# Altium schematic sheet Power_Supplies.SchDoc
size 594 x 420 mm; SheetNumber: 1; SheetTotal: 2
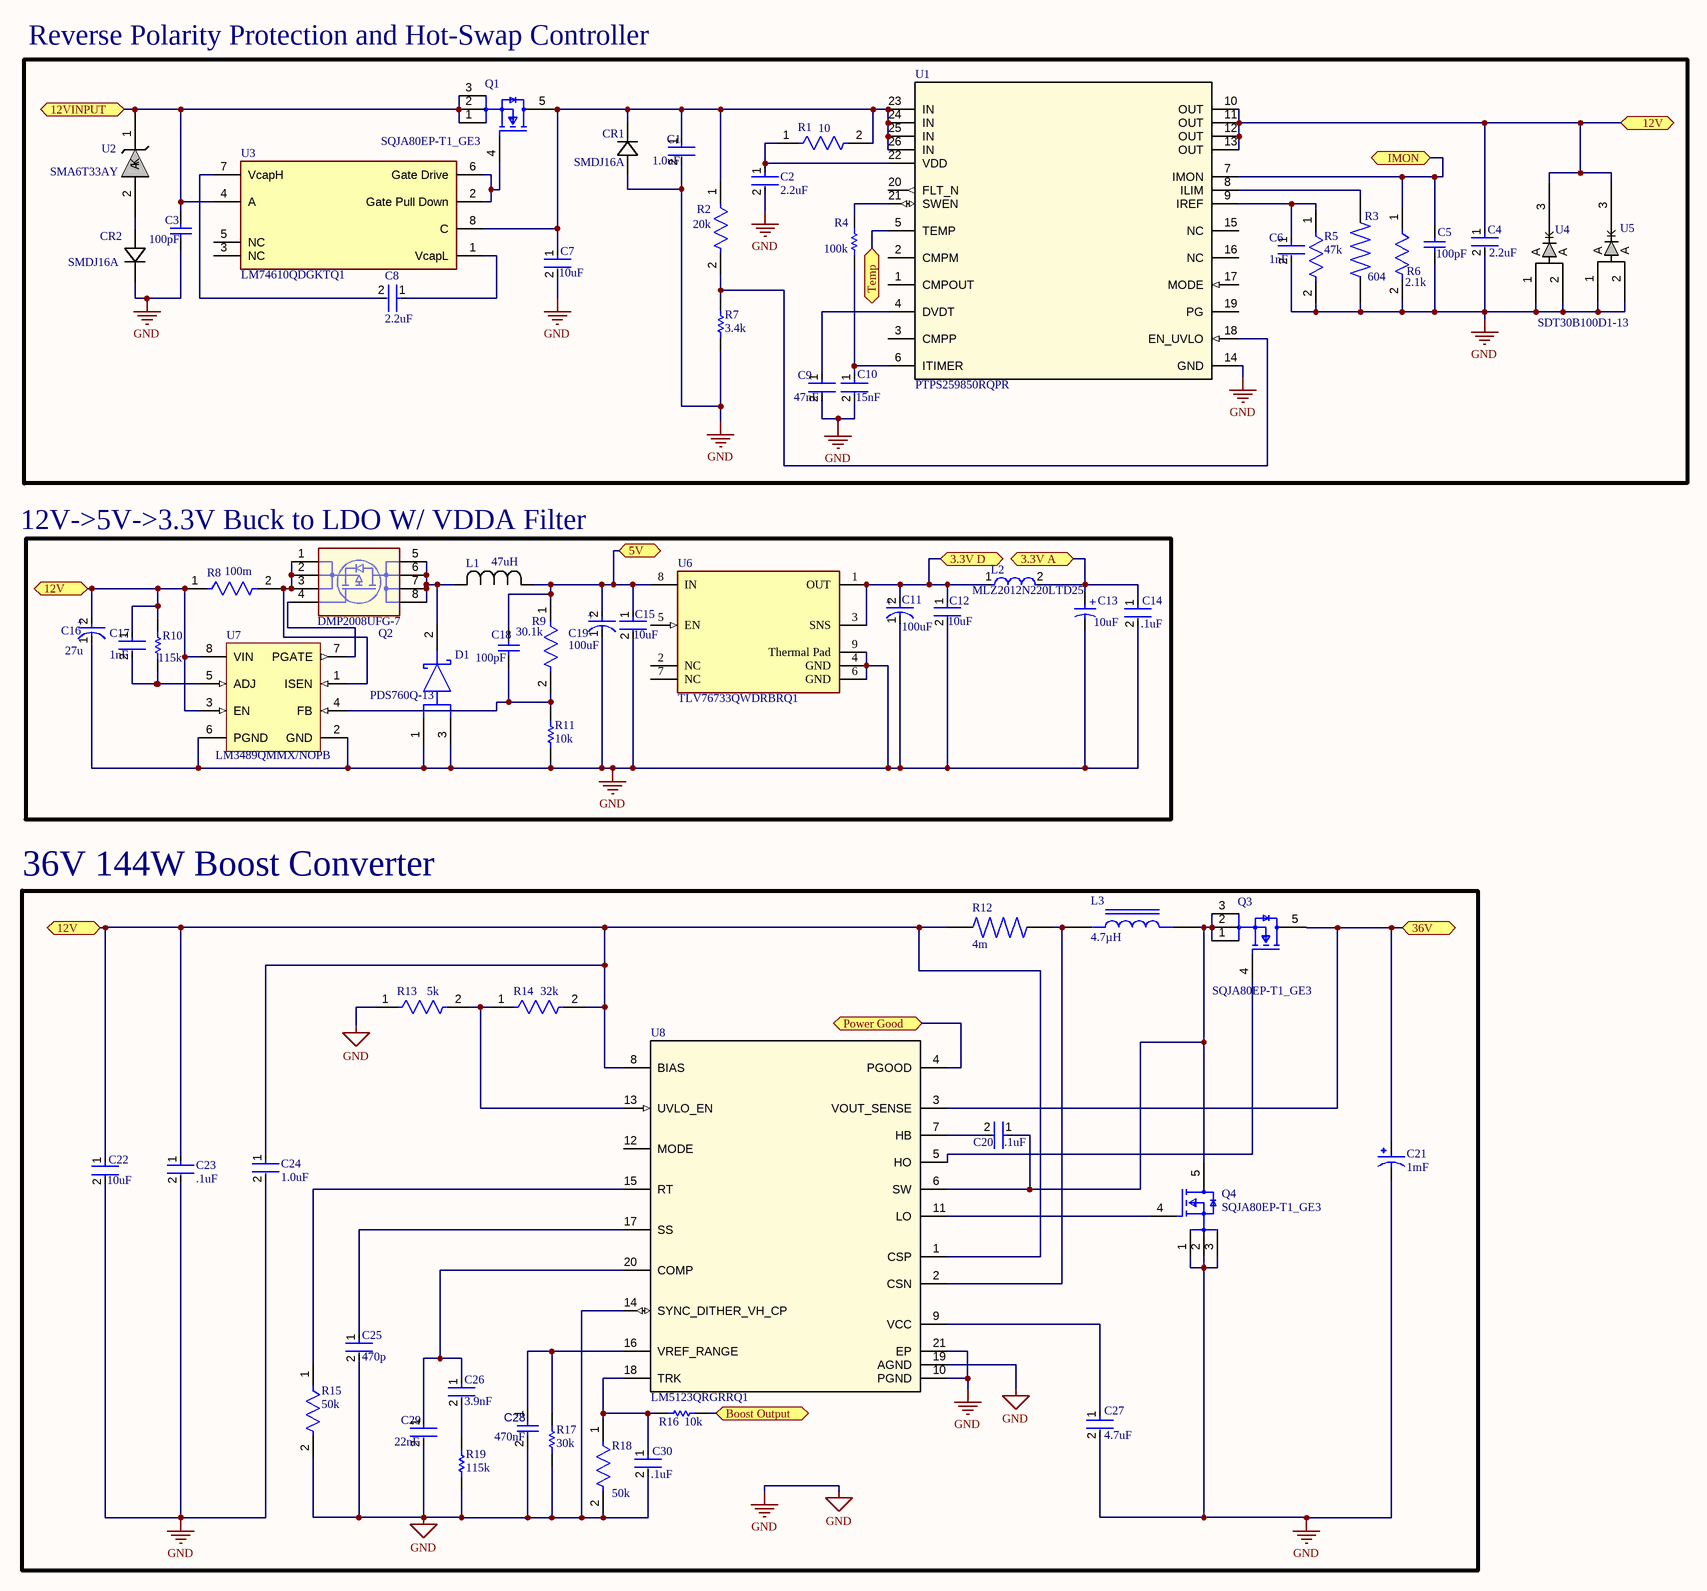
[diagram p0: Power_Supplies.SchDoc]

## Parts
C1  1.0uF  [FP-GRM155-0_1-MFG]
C2  2.2uF  [FP-GRM155-0_2-IPC_B]
C3  100pF  [CAPC1005X55X25ML05T05]
C4  2.2uF  [FP-GRM155-0_2-IPC_B]
C5  100pF  [CAPC1005X55X25ML05T05]
C6  1nF  [FP-C1005-050-0_05-IPC_B]
C7  10uF  [FP-CL21-IPC_A]
C8  2.2uF  [FP-GRM155-0_2-IPC_B]
C9  47nF  [FP-C1005-050-0_05-IPC_B]
C10  15nF  [FP-GRT155-0_05-IPC_A]
C11  100uF  [FP-FKF-MFG]
C12  10uF  [FP-CL21-IPC_A]
C13  10uF  [WCAP-ASLI_D4H5.5]
C14  .1uF  [FP-GRM155-0_05-MFG]
C15  10uF  [FP-CL21-IPC_A]
C16  27u  [FP-OS-CON-SMT-C6-MFG]
C17  1nF  [FP-C1005-050-0_05-IPC_B]
C18  100pF  [CAPC1005X55X25ML05T05]
C19  100uF  [FP-FKF-MFG]
C20  .1uF  [FP-GRM155-0_05-MFG]
C21  value 1mF  [CAP_EEEFK1H102AV]  (hidden comment: EEEFK1H102AV)
C22  10uF  [FP-CL21-IPC_A]
C23  .1uF  [FP-GRM155-0_05-MFG]
C24  1.0uF  [FP-GRM155-0_1-MFG]
C25  470p  [FP-GCM155-0_1-IPC_A]
C26  3.9nF  [FP-CC0402-MFG]
C27  4.7uF  [FP-CL829-IPC_C]
C28  value 470nF  [CAPC0402(1005)60_L]  (hidden comment: Capacitor 470nF +/-40% 10V 0402)
C29  22nF  [FP-0402-L_1_0_0_05-W_0_5-IPC_B]
C30  .1uF  [FP-GRM155-0_05-MFG]
CR1  SMDJ16A  [SMDJSeries_LTF]
CR2  SMDJ16A  [SMDJSeries_LTF]
D1  PDS760Q-13  [FP-PowerDI5-MFG]
L1  47uH  [IND_PA4343PM4343_FP2_PUL]
L2  MLZ2012N220LTD25  [FP-MLZ2012-1_25-IPC_A]
L3  value 4.7µH  [IND_PQ2614BLA-4R7K]  (hidden comment: PQ2614BLA-4R7K)
Q1  SQJA80EP-T1_GE3  [FP-S19-0643-SINGLE-MFG]
Q2  DMP2008UFG-7  [DMP2008UFG-7_DIO]
Q3  SQJA80EP-T1_GE3  [FP-S19-0643-SINGLE-MFG]
Q4  SQJA80EP-T1_GE3  [FP-S19-0643-SINGLE-MFG]
R1  10  [FP-RP73P-1E-MFG]
R2  20k  [FP-AC0402-IPC_A]
R3  value 604  [RES_ERA3AEB6040V]  (hidden comment: ERA3AEB6040V)
R4  100k  [RESC1005X40X25ML05T10]
R5  47k  [FP-RT0603-MFG]
R6  2.1k  [FP-RG1608-IPC_C]
R7  3.4k  [RESC2013X60X30ML20T20]
R8  100m  [FP-CSRN2512-IPC_B]
R9  30.1k  [FP-RK73H1E-MFG]
R10  115k  [RESC1005X40X25ML05T10]
R11  10k  [RESC1005X40X25ML05T10]
R12  value 4m  [RESC6331X87N]  (hidden comment: TLR3APDTE4L00F75)
R13  5k  [FP-RC0402-MFG]
R14  32k  [FP-RN73R1E-IPC_C]
R15  50k  [FP-CRCW0402-e3-IPC_A]
R16  10k  [RESC1005X40X25ML05T10]
R17  30k  [RESC2013X60X35LL10T20]
R18  50k  [FP-CRCW0402-e3-IPC_A]
R19  115k  [RESC1005X40X25ML05T10]
U1  PTPS259850RQPR  [RQP0026A-MFG]
U2  SMA6T33AY  [SMA_UNI_STM]
U3  LM74610QDGKTQ1  [FP-DGK0008A-MFG]
U4  SDT30B100D1-13  [TO252_DIO]  (value not drawn)
U5  SDT30B100D1-13  [TO252_DIO]
U6  TLV76733QWDRBRQ1  [FP-DRB0008J-IPC_C]
U7  LM3489QMMX/NOPB  [DGK0008A_M]
U8  LM5123QRGRRQ1  [RGR0020C-IPC_A]

## Blocks framed on the sheet
Reverse Polarity Protection and Hot-Swap Controller: C1-C10 CR1 CR2 Q1 R1-R7 U1-U5
36V 144W Boost Converter: C20-C30 L3 Q3 Q4 R12-R19 U8

## Ports
3.3V A (bidir, see MCU[6C]), 3.3V D (bidir, see MCU[3D], MCU[3G], MCU[4D], MCU[6D], MCU[6F], MCU[7D], MCU[7F], MCU[7G], MCU[8F], MCU[9F], MCU[10C], MCU[10F]), 5V (bidir, see MCU[5F]), 12V (bidir, see Power_Supplies[2C], Power_Supplies[2D]), 12V (bidir, see Power_Supplies[2C], Power_Supplies[6B]), 12V (bidir, see Power_Supplies[2D], Power_Supplies[6B]), 12VINPUT (bidir, see MCU[8F]), 36V (bidir, see MCU[4F], MCU[4G]), Boost Output (bidir, see MCU[9D]), IMON (bidir, see MCU[7D]), Power Good (bidir, see MCU[7D]), Temp (bidir, see MCU[9C])

## Nets
GND: C1.2 C2.2 C3.2 C4.2 C5.2 C6.2 C7.2 C9.2 C10.2 C11.1(C) C12.2 C13.2(N) C14.2 C15.2 C16.1(C) C19.1(C) C21.2 C22.2 C23.2 C24.2 C25.2 C27.2 C28.2 C29.2 C30.2 CR1.2 CR2.1 D1.1(A) D1.3(A) Q4.1(S) Q4.2(S) Q4.3(S) R3.2 R5.2 R6.2 R7.2 R11.2 R13.1 R15.2 R17.2 R18.2 R19.2 U1.14(GND) U4.1(A) U4.2(A) U5.1(A) U5.2(A) U6.4(GND) U6.6(GND) U6.9(Thermal_Pad) U7.2(GND) U7.6(PGND) U8.10(PGND) U8.14(SYNC_DITHER_VH_CP) U8.19(AGND) U8.21(EP)
3.3V A: C13.1(P) C14.1 L2.2 ; port 3.3V A
3.3V D: C11.2(A) C12.1 L2.1 U6.1(OUT) U6.3(SNS) ; port 3.3V D
5V: C15.1 C18.1 C19.2(A) L1.1 R9.1 U6.8(IN) ; port 5V
12V: C4.1 C16.2(A) C17.1 C22.1 C23.1 C24.1 R8.1 R10.1 R12.1 R14.2 U1.10(OUT) U1.11(OUT) U1.12(OUT) U1.13(OUT) U4.3(K) U5.3(K) U7.3(EN) U7.8(VIN) U8.1(CSP) U8.8(BIAS) ; port 12V
12VINPUT: C3.1 Q1.1(S) Q1.2(S) Q1.3(S) U2.1(K) U3.4(A) ; port 12VINPUT
36V: C21.1 Q3.5(D) U8.3(VOUT_SENSE) ; port 36V
Boost Output: R16.1 ; port Boost Output
IMON: C5.1 R6.1 U1.7(IMON) ; port IMON
Power Good: U8.4(PGOOD) ; port Power Good
Temp: U1.5(TEMP) ; port Temp
NetC1_1: C1.1 C7.1 CR1.1 Q1.5(D) R1.2 R2.1 U1.23(IN) U1.24(IN) U1.25(IN) U1.26(IN) U3.8(C)
NetC2_1: C2.1 R1.1 U1.22(VDD)
NetC6_1: C6.1 R5.1 U1.9(IREF)
NetC8_1: C8.1 U3.1(VcapL)
NetC8_2: C8.2 U3.7(VcapH)
NetC9_1: C9.1 U1.4(DVDT)
NetC10_1: C10.1 R4.2 U1.6(ITIMER)
NetC17_2: C17.2 R10.2 U7.5(ADJ)
NetC18_2: C18.2 R9.2 R11.1 U7.4(FB)
NetC20_1: C20.1 L3.2 Q3.1(S) Q3.2(S) Q3.3(S) Q4.5(D) U8.6(SW)
NetC20_2: C20.2 U8.7(HB)
NetC25_1: C25.1 U8.17(SS)
NetC26_1: C26.1 C29.1 U8.20(COMP)
NetC26_2: C26.2 R19.1
NetC27_1: C27.1 U8.9(VCC)
NetC28_1: C28.1 R17.1 U8.16(VREF_RANGE)
NetC30_1: C30.1 R16.2 R18.1 U8.18(TRK)
NetCR2_2: CR2.2 U2.2(A)
NetD1_2: D1.2(C) L1.2 Q2.5(D) Q2.6(D) Q2.7(D) Q2.8(D)
NetL3_1: L3.1 R12.2 U8.2(CSN)
NetQ1_4: Q1.4(G) U3.2(Gate_Pull_Down) U3.6(Gate_Drive)
NetQ2_1: Q2.1(S) Q2.2(S) Q2.3(S) R8.2 U7.1(ISEN)
NetQ2_4: Q2.4(G) U7.7(PGATE)
NetQ3_4: Q3.4(G) U8.5(HO)
NetQ4_4: Q4.4(G) U8.11(LO)
NetR2_2: R2.2 R7.1 U1.18(EN_UVLO)
NetR3_1: R3.1 U1.8(ILIM)
NetR4_1: R4.1 U1.21(SWEN)
NetR13_2: R13.2 R14.1 U8.13(UVLO_EN)
NetR15_1: R15.1 U8.15(RT)

Not connected (* = marked no-connect by the designer): U1 1(CMPOUT) 2(CMPM) 3(CMPP) 15(NC) 16(NC) 17(MODE) 19(PG) 20(FLT_N); U3 3(NC) 5(NC); U6 2(NC) 5(EN) 7(NC); U8 12(MODE)

## Notes on the sheet
- (near Q2) 12V->5V->3.3V Buck to LDO W/ VDDA Filter
- DWG NO:
- REV:
- THIS DOCUMENT AND THE DATA DISCLOSED HEREIN OR
- HEREWITH IS THE PROPERTY OF ALTIUM LIMITED AND MAY
- BE FREELY DISTRIBUTED IN WHOLE. NO RIGHTS ARE
- RESERVED OR EXPRESS OR IMPLIED WARANTEE GIVEN.
- REVISION
- DESCRIPTION
- DATE
- APPROVED
- ENG:
- APPROVALS
- PROJECT
- DSN:
- CHK:
- REFERENCE DOCUMENTS
- PROJECT REVISION:
- TITLE
- DOCUMENT REVISION:
- DESIGN ITEM:
- BOM:
- FAB DWG:
- PCB DWG:
- ASSY DWG:
- SCALE:
- A2
- SIZE
- CAGE CODE
- FILE NAME
- DWG NO.
- SHEET
- OF
- REV
- (in symbol CMP-2000-06208-3) +
- (in symbol CMP-03913-53914566-1) +
- (in symbol CMP-05428-000702-1) +

## Library data of the parts
C1 C24 = CMP-06035-041084-1: Chip Multilayer Ceramic Capacitors for General Purpose, 0402, 1.0uF, X5R, 15%, 10%, 50V
C2 C4 C8 = CMP-06035-001793-1: Chip Multilayer Ceramic Capacitors for General Purpose, 0402, 2.2uF, X5R, 15%, 10%, 16V; Tolerance: 10%; Capacitance: 2.2uF; Packaging: Tape and Reel; Lead Free: Lead Free; Mount: Surface Mount; Width: 0.02inch; Case/Package: 0402; Case Code (Metric): 1005; Thickness: 0.022inch; Max Operating Temperature: 85°C; Min Operating Temperature: -55°C; Voltage Rating: 16V; Voltage Rating (DC): 16V; Material: Ceramic; Height: 0.3mm; Case Code (Imperial): 0402; Length: 0.039inch; Value: 2.2uF
C3 C5 = CMP-2008-01232-1: Multilayer Ceramic Capacitor, 100 pF, 25 V, ± 10%, X7R, 0402 [1005 Metric]; Part Number: VJ0402Y101KXXPW1BC; Manufacturer: Vitramon
C6 C17 = CMP-08246-005584-1: Multilayer Ceramic Capacitors 1nF ±5% 100V C0G SMD 0402; Voltage Rating: 100V; Termination: SMD/SMT; Width: 0.5mm; Packaging: Tape and Reel; Max Operating Temperature: 125°C; Length: 0.039inch; Capacitance: 1nF; Case Code (Metric): 1005; Dielectric: C0G; Height: 0.5mm; Package Quantity: 10000; Weight: 2.3E-05oz; Thickness: 0.022inch; Case/Package: 0402; RoHS Compliant: Yes; Case Code (Imperial): 0402; Min Operating Temperature: -55°C; Mount: Surface Mount; Voltage Rating (DC): 100V; Tolerance: 5%; Value: 1nF
C7 C12 C15 C22 = CMP-13271-002975-1: CL21 Series 0805 10uF 25V ±10% Tolerance X5R Multilayer Ceramic Chip Capacitor; Case Code (Imperial): 0805; Length: 2mm; Case/Package: 0805; Packaging: Tape and Reel; Width: 0.049inch; Tolerance: 10%; Mount: Surface Mount; Min Operating Temperature: -55°C; Thickness: 0.057inch; Height: 1.25mm; Dielectric: X5R; Package Quantity: 1; Depth: 1.25mm; Capacitance: 10uF; Voltage Rating: 25V; Case Code (Metric): 2012; Max Operating Temperature: 85°C; Radiation Hardening: No; Value: 10uF
C9 = CMP-08246-006396-1: Multilayer Ceramic Capacitors 47nF ±10% 35V X7R SMD 0402; Lead Free: Lead Free; Height: 0.5mm; RoHS Compliant: Yes; Dielectric: X7R; Thickness: 0.022inch; Length: 1mm; Capacitance: 47nF; Min Operating Temperature: -55°C; Width: 0.02inch; Voltage Rating: 35V; Construction: Flat; Package Quantity: 1; Packaging: Tape and Reel; Tolerance: 10%; Voltage Rating (DC): 35V; Case Code (Imperial): 0402; Case Code (Metric): 1005; Dielectric Material: Ceramic; Mount: Surface Mount; Depth: 0.5mm; Weight: 2.3E-05oz; Termination: SMD/SMT; Case/Package: 0402; Series: C; Max Operating Temperature: 125°C; Value: 47nF
C10 = CMP-06035-035184-1: Multi-Layer Ceramic Capacitor 15nF 50V X7R ±10% 0402 Paper T/R
C11 C19 = CMP-2000-06208-3: Radial Can - SMD ALUMINUM ELECTROLYTIC CAPACITOR FK 50V 100muF ±20% 0.315Dia 8.00mm; Leakage Current: 3uA; ESR (Equivalent Series Resistance): 340mR; Material: Aluminium; Ripple Current: 350mA; Life (Hours): 2000Hour; Min Operating Temperature: -55°C; Contact Plating: Tin; REACH SVHC: No SVHC; RoHS Compliant: Yes; Width: 10mm; Radiation Hardening: No; Termination: SMD/SMT; Packaging: Tape and Reel; Max Operating Temperature: 105°C; Case/Package: Radial; Voltage Rating: 50V; Length: 10.2mm; Voltage: 50V; Package Quantity: 1; Voltage Rating (DC): 50V; Height - Seated (Max): 0.402inch; Mount: Surface Mount; Impedance: 340mR; Construction: Cylindrical; Height: 10.2mm; Lead Free: Lead Free; Dielectric Material: Aluminium; Series: FK; Tolerance: 20%; Diameter: 8mm; Ripple Current (AC): 350mA; Capacitance: 100uF; Number of Pins: 2; Value: 100uF
C13 = CMP-03913-53914566-1: 865080340001 WCAP-ASLI Aluminum Electrolytic Capacitors; Impedance: 2.2Ω; ESR (Equivalent Series Resistance): 1.66693Ω; Life (Hours): 2000hours; Ripple Current (AC): 80mA; Capacitance: 10µF; Voltage Rating (DC): 16V; Polarity: Polar; Leakage Current: 3µA; Insulation Resistance: 5.33333MΩ; Tolerance: 20%; Value: 10µF; Case/Package: Radial; Min Operating Temperature: -55°C; Height: 5.5mm; Lead Free: Lead Free; Packaging: Tape & Reel (TR); REACH SVHC: Unknown; Length: 5.5mm; Height - Seated (Max): 5.5118mm; Max Operating Temperature: 105°C; NexarPartId: 53914566; Diameter: 4mm; Ripple Current: 80mA; Mount: Surface Mount; RoHS: Compliant; Voltage Rating: 16V; Width: 4.3mm
C14 C20 C23 C30 = CMP-06035-023139-1: Chip Multilayer Ceramic Capacitors for General Purpose, 0402, 0.10uF, B, 10%, 10%, 50V; Capacitance: 100nF; Value: 100nF; Length: 1mm; Width: 500um; Voltage Rating (DC): 50V; Lead Free: Lead Free; Tolerance: 10%; Thickness: 500um
C16 = CMP-05428-000702-1: Conductive Polymer Aluminum Solid Capacitors (OS-CON) 27uF ±20% 20V; Ripple Current (AC): 1.45A; Polarity: Polar; Leakage Current: 108uA; ESR (Equivalent Series Resistance): 60mR; Life (Hours): 2000Hour; Dissipation Factor: 10%; Capacitance: 27uF; Max Operating Temperature: 105°C; Min Operating Temperature: -55°C; Termination: SMD/SMT; Packaging: Tape and Reel; Voltage Rating: 20V; Mount: Surface Mount; REACH SVHC: No SVHC; Construction: Cylindrical; Height - Seated (Max): 0.236inch; Ripple Current: 1.45A; Series: OS-CON™, SVP; Number of Pins: 6; Voltage: 20V; Package Quantity: 1000; Voltage Rating (DC): 20V; RoHS Compliant: Yes; Length: 5.9mm; Case/Package: Radial; Diameter: 6.3mm; Height: 5.9mm; Tolerance: 20%; Value: 27uF
C18 = CMP-2008-01232-1: VJ0402Y101KXXPW1BC Vishay Multilayer Ceramic Capacitor, 100 pF, 25 V, ± 10%, X7R, 0402 [1005 Metric]; Manufacturer: Vitramon; Part Number: VJ0402Y101KXXPW1BC
C21 = CMP-001-00086-1: 1000ÂµF 50V Aluminum Electrolytic Capacitors Radial, Can - SMD 73mOhm @ 100kHz 5000 Hrs @ 105Â°C; MF: Panasonic; MP: EEE-FK1H102AV; Pins: 2; Availability: In Stock; SnapEDA_Link: https://www.snapeda.com/parts/EEE-FK1H102AV/Panasonic/view-part/?ref=snap; Price: None; Case/Package: RADIAL-2 Panasonic; Component Type: Standard; Design Item ID: EEEFK1H102AV; Check_prices: https://www.snapeda.com/parts/EEE-FK1H102AV/Panasonic/view-part/?ref=eda; Source: EEEFK1H102AV.SchLib
C25 = CMP-06035-004538-1: Ceramic Capacitor for Automotive 470nF ±20% 10VDC X7S 0402 Paper T/R
C26 = CMP-03422-000890-1: CAP CER 3900PF 50V X7R 0402; Manufacturer Part Number: CC0402KRX7R9BB392; Manufacturer: YAGEO; Tolerance: 0.1; Temperature Coefficient: 30ppm/°C; Material: Ceramic; Automotive Grade: NA; Digikey Description: CAP CER 3900PF 50V X7R 0402; Octopart: https://octopart.com/cc0402krx7r9bb392-yageo-9291741; Category: Cap; Value: 3.9 nF; Temperature Characteristic: X7R; Footprint Url: http://www.yageo.com/exep/pages/download/literatures/UPY-C_GEN_24.pdf; Height: 0.55mm; ComponentLink2Description: Datasheet; Capacitance: 3.9 nF; RoHS: TRUE; Device Class L1: Passive Components; ComponentLink2URL: http://www.yageo.com/documents/recent/UPY-GP_NP0_16V-to-50V_16.pdf; Temperature Range Low: -55°C; Automotive: No; Temperature: -55°C to +125°C; Ipc Land Pattern Name: CAPC10050X50; Voltage Rating: 50 V; Device Class L3: Ceramic Capacitors; Device Class L2: Capacitors; Mouser Description: Multilayer Ceramic Capacitors MLCC - SMD/SMT 3.9nF 50V X7R 10%; Package: CC0402; Lead Free: Yes; Temperature Range High: +125°C
C27 = CMP-13271-001468-1: Cap Ceramic 4.7uF 16V X5R ±20% SMD 0402 +85°C Paper T/R; Mount: Surface Mount; Case Code (Metric): 1005; Case/Package: 0402; Length: 0.039inch; Capacitance: 4.7uF; Voltage Rating: 16V; Max Operating Temperature: 85°C; Tolerance: 20%; Thickness: 0.022inch; Min Operating Temperature: -55°C; Case Code (Imperial): 0402; Packaging: Tape and Reel; Width: 0.02inch; Value: 4.7uF
C28 = CMP-001-00060-4: Chip Capacitor, 470nF +/-40%, 10V, 0402, Thickness 0.6 mm; Tolerance: 20%; Max Operating Temperature: 85°C; Case/Package: 0402; Voltage Rating: 10V; Min Operating Temperature: -55°C; Mounting Technology: SMT; Pins: 2
C29 = CMP-14477-001820-2: Multilayer Ceramic Capacitor 0.022uF 16V 10% 0402 Paper T/R; RoHS Compliant: Yes
CR1 CR2 = CMP-025-000000-3: Description; Manufacturer_Name: Littelfuse Inc; Design Item ID: SMDJ16A; Source: SMDJ16A.SchLib; Manufacturer_Part_Number: SMDJ16A; Copyright: Copyright (C) 2025 Ultra Librarian. All rights reserved.
D1 = CMP-12790-000077-1: DIODE SCHOTTKY 60V 7A POWERDI5; Forward Voltage: 560mV; Peak Non-Repetitive Surge Current: 275A; Peak Reverse Current: 20mA; Element Configuration: Single; Weight: 0.003386oz; Average Rectified Current: 7A; Max Repetitive Reverse Voltage (Vrrm): 60V; Forward Current: 7A; Max Reverse Voltage (DC): 60V; Mount: Surface Mount; Package Quantity: 5000; Packaging: Tape and Reel; Max Forward Surge Current (Ifsm): 275A; Min Operating Temperature: -65°C; Max Operating Temperature: 150°C; Contact Plating: Tin; Number of Pins: 5
L1 = CMP-006-00027-2: Description; Manufacturer_Name: Pulse Electronics Corporation; Design Item ID: PM4343.473NLT; Copyright: Copyright (C) 2025 Ultra Librarian. All rights reserved.; Source: PM4343P473NLT.SchLib; Manufacturer_Part_Number: PM4343.473NLT
L2 = CMP-08253-000331-1: Shielded Multilayer Inductor 22uH ±20% 300mA 871mΩ AEC-Q200 SMD 0805; Resistance: 0.871R; Test Frequency: 2MHz; Core Material: Ferrite; Saturation Current: 70mA; DC Resistance (DCR): 871mR; Max Operating Temperature: 125°C; Max DC Current: 300mA; Lead Free: Lead Free; Case Code (Imperial): 0805; Case Code (Metric): 2012; Case/Package: 0805; Width: 0.049inch; Packaging: Tape and Reel; Length: 0.079inch; Tolerance: 20%; Termination: SMD/SMT; Weight: 0.000194oz; Height - Seated (Max): 0.057inch; Inductance: 22uH; Ratings: AEC-Q200; Current Rating: 300mA; RoHS Compliant: Yes; Package Quantity: 2000; Mount: Surface Mount; Shielding: Shielded; Height: 1.25mm; Min Operating Temperature: -55°C
L3 = CMP-006-00025-5: MF: {'manufacturer': u'Bourns Inc.'}; MP: PQ2614BLA-4R7K; Case/Package: None; Availability: Unavailable; Design Item ID: PQ2614BLA-4R7K; Component Type: Standard; Source: PQ2614BLA-4R7K.SchLib; Pins: 2; Price: None
Q1 Q3 Q4 = CMP-02550-000158-2: MOSFET N-CH 80V 60A POWERPAKSO-8
Q2 = CMP-022-000000-3: Description; Manufacturer_Name: Diodes Inc; Design Item ID: DMP2008UFG-7; Source: DMP2008UFG-7.SchLib; RefDes: RefDes; Manufacturer_Part_Number: DMP2008UFG-7; Type: Type; Copyright: Copyright (C) 2025 Ultra Librarian. All rights reserved.
R1 = CMP-03211-006729-1: RP73P 0402 10Ω 0.1W 25ppm/°C 0.10% 50V; Manufacturer: TE Connectivity; Manufacturer Part Number: RP73PF1E10RBTD; Tolerance: 0.10%; Package: RP73P-1E; Temperature Coefficient: 25ppm/°C; Voltage Rating: 50V; Composition: Thin Film; Temperature Range High: +155°C; Series: RP73P; Device Class L3: Chip SMD Resistors; Power Rating: 0.1W; Ipc Land Pattern Name: RESC10050X30; Value: 10Ω; Temperature Range Low: -55°C; Height: 0.35mm; Automotive: No; Device Class L2: Resistors; Resistance: 10Ω; ComponentLink2Description: Datasheet; Category: Res; Temperature: -55°C to +155°C; Device Class L1: Passive Components; Octopart: https://octopart.com/rp73pf1e10rbtd-te+connectivity-89229905; ComponentLink2URL: https://www.te.com/commerce/DocumentDelivery/DDEController?Action=srchrtrv&DocNm=1773272&DocType=DS&DocLang=English; RoHS: TRUE; Lead Free: Yes
R2 = CMP-03412-040395-1: RES 20kΩ ±1% 0.125W 0402
R3 = CMP-009-00179-2: MF: {'manufacturer': u'Panasonic Electronic Components'}; Source: ERA3AEB6040V.SchLib; Design Item ID: ERA3AEB6040V; Pins: 2; Availability: Unavailable; Price: None; Case/Package: None; MP: ERA3AEB6040V; Component Type: Standard
R4 = CMP-2002-07852-1: Res Thick Film 0402 100K Ohm 1% 0.063W(1/16W) ±100ppm/C Pad SMD T/R; Manufacturer: Yageo; Part Number: RC0402FR-13100KL
R5 = CMP-03412-016905-1: RES SMD 47K OHM 0.1% 1/10W 0603; Manufacturer: Yageo; Manufacturer Part Number: RT0603BRE0747KL; Value: 47KΩ; Tolerance: 0.001; Voltage Rating: 75V; Temperature Coefficient: 50 ppm/°C; Power Rating: 0.1W; Device Class L1: Passive Components; Category: Res; Height: 0.55mm; Lead Free: Yes; Ipc Land Pattern Name: RESC16080X45; Device Class L3: Chip SMD Resistors; Automotive: No; Temperature: -55°C to +155°C; RoHS: TRUE; Digikey Description: RES SMD 47K OHM 0.1% 1/10W 0603; Device Class L2: Resistors; Series: RT; Temperature Range High: +155°C; Composition: Thin Film; ComponentLink2Description: Datasheet; Resistance: 47KΩ; ComponentLink2URL: http://www.yageo.com/documents/recent/PYu-RT_1-to-0.01_RoHS_L_9.pdf; Package: RT0603; Footprint Url: http://www.yageo.com/exep/pages/download/literatures/PYu-R_Mount_10.pdf; Octopart: https://octopart.com/rt0603bre0747kl-yageo-1475396; Temperature Range Low: -55°C
R6 = CMP-2000-02096-2: Automotive Metal Thin Film Chip Resistor, 0603, 2.1kΩ, 0.1%, 25ppm/°C, 0.1W, 100V; Max Power Dissipation: 100mW; Resistance: 2.1kR; Voltage Rating (DC): 75V; Value: 2.1kR; Length: 1.6mm; Series: RG; Weight: 7.1E-05oz; Width: 0.8mm; Termination: SMD/SMT; Tolerance: 0.1%; Case Code (Imperial): 0603; Number of Terminations: 2; Lead Free: Lead Free; Features: Automotive AEC-Q200; Case Code (Metric): 1608; Min Operating Temperature: -55°C; Case/Package: 0603; Voltage Rating: 100V; Resistor Type: Thin Film; Max Operating Temperature: 155°C; Packaging: Tape and Reel; Power Rating: 100mW; Temperature Coefficient: 25ppm/°C; Height: 0.4mm
R7 = CMP-2001-02336-1: Part Number: RK73H2ATTD3401F; Manufacturer: KOA Speer
R8 = CMP-26527-004947-1: Res Thick Film 2512 0.1Ω 1% 2W ±200ppm/°C Molded SMD Plastic T/R; Resistance: 100mR; Value: 100mR; Resistor Type: Thick Film; Contact Plating: Tin; Max Power Dissipation: 2W; Tolerance: 1%; Min Operating Temperature: -55°C; Case/Package: 2512; Radiation Hardening: No; Case Code (Imperial): 2512; Number of Terminations: 2; Series: CSRN; Width: 0.124inch; Power Rating: 2W; RoHS Compliant: Yes; Mount: Surface Mount; Temperature Coefficient: 200ppm/°C; Height: 0.028inch; Packaging: Tape and Reel; Case Code (Metric): 6432; Max Operating Temperature: 155°C; Length: 0.25inch
R9 = CMP-04015-107820-1: 30.1kΩ ±1% 0.1W Chip Resistor 0402 Thick Film AEC-Q200 Qualified; Voltage Rating: 50V; Temperature Coefficient: 100ppm/°C; Resistance: 30.1kR; Power Rating: 63mW; Value: 30.1kR; Width: 0.5mm; Case Code (Imperial): 0402; Package Quantity: 10000; Tolerance: 1%; Lead Free: Contains Lead; Case Code (Metric): 1005; Min Operating Temperature: -55°C; Voltage Rating (DC): 50V; Case/Package: 0402; Max Operating Temperature: 155°C; Series: RK73H; Height: 0.35mm; RoHS Compliant: No; Packaging: Tape and Reel; Length: 1mm; Termination: SMD/SMT
R10 = CMP-2002-07115-1: Res Thick Film 0402 115K Ohm 1% 0.063W(1/16W) ±100ppm/C Pad SMD T/R; Part Number: RC0402FR-07115KL; Manufacturer: Yageo / Phycomp
R11 R16 = CMP-2002-03043-1: Part Number: CRCW040210K0FKEDHP; Manufacturer: Vishay Dale
R12 = CMP-009-00178-3: 4 mOhms Â±1% 3W Chip Resistor 2512 (6432 Metric) Automotive AEC-Q200, Current Sense Metal Element; MF: KOA Speer; Component Type: Standard; Availability: Unavailable; MP: TLR3APDTE4L00F75; SnapEDA_Link: https://www.snapeda.com/parts/TLR3APDTE4L00F75/KOA%20Speer/view-part/4194870/?ref=snap; Price: None; Pins: 2; Source: TLR3APDTE4L00F75.SchLib; Case/Package: 6331 KOA; Design Item ID: TLR3APDTE4L00F75; Check_prices: https://www.snapeda.com/parts/TLR3APDTE4L00F75/KOA%20Speer/view-part/4194870/?ref=eda
R13 = CMP-03412-013078-1: RES SMD 5K OHM 1% 1/16W 0402; Manufacturer: Yageo; Manufacturer Part Number: RC0402FR-075KL; Resistance: 5kΩ; Temperature Coefficient: 100ppm/°C; Power Rating: 0.0625W; Voltage Rating: 50V; Value: 5kΩ; Temperature Range Low: -55°C; Lead Free: Yes; RoHS: TRUE; Device Class L2: Resistors; Package: RC0402; Footprint Url: https://pccomponents.com/datasheets/YAGEO-20RESISTORS.PDF; Height: 0.4mm; ComponentLink2URL: http://www.yageo.com/documents/recent/PYu-RC_Group_51_RoHS_L_10.pdf; Temperature: -55°C to +155°C; Composition: Thick Film; Device Class L1: Passive Components; Series: RC_L; Ipc Land Pattern Name: RESC10050X35; Tolerance: 1%; Device Class L3: Chip SMD Resistors; Temperature Range High: +155°C; Category: Res; Automotive: No; Octopart: https://octopart.com/rc0402fr-075kl-yageo-25450038; Digikey Description: RES SMD 5K OHM 1% 1/16W 0402; ComponentLink2Description: Datasheet
R14 = CMP-04015-001524-1: 32kΩ ±0.1% 0.063W, 1/16W Chip Resistor 0402 (1005 Metric) Moisture Resistant Thin Film
R15 R18 = CMP-02407-005152-1: RES Thick Film, 50kΩ, 1%, 0.063W, 100ppm/°C, 0402; Power Rating: 63mW; Voltage Rating: 50V; Resistance: 50kR; Value: 50kR; Package Quantity: 10000; Case/Package: 0402; Max Operating Temperature: 155°C; Case Code (Metric): 1005; Termination: SMD/SMT; Lead Free: Lead Free; Height: 0.35mm; Width: 0.5mm; Packaging: Tape and Reel; Min Operating Temperature: -55°C; Length: 1mm; Tolerance: 1%; Case Code (Imperial): 0402; Weight: 2.3E-05oz
R17 = CMP-2001-01369-1: Part Number: RC0805JR-0730KL; Manufacturer: Yageo
R19 = CMP-2002-07115-1: Part Number: RC0402FR-07115KL; Manufacturer: Yageo / Phycomp
U1 = CMP-013-000000-2: 4.5-V to 16-V, 0.59-mÎ©, 70-A stackable compact eFuse with accurate and fast current monitor 26-VQFN-HR -40 to 125; Manufacturer_Name: Texas Instruments; Manufacturer_Part_Number: PTPS259850RQPR; RefDes: RefDes; TYPE: TYPE; Source: PTPS259850RQPR.SchLib; Copyright: Copyright (C) 2025 Ultra Librarian. All rights reserved.; Design Item ID: PTPS259850RQPR
U2 = CMP-004-00032-4: Automotive 600 W, 28.2 V TVS in SMA; Manufacturer_Name: STMicroelectronics; Datasheet: https://www.st.com/resource/en/datasheet/sma6ty.pdf; RefDes: RefDes; Copyright: Copyright (C) 2025 Ultra Librarian. All rights reserved.; Design Item ID: SMA6T33AY; Type: Type; Source: SMA6T33AY.SchLib; Manufacturer_Part_Number: SMA6T33AY
U3 = CMP-04910-000005-1: IC SMART DIODE CTLR 8VSSOP; Manufacturer: Texas Instruments; Number Of Outputs: 1; Max Supply Voltage: 42V; Nominal Supply Current: 0uA; Min Supply Voltage: 0.48V; Automotive Grade: Grade 1; Standoff Height: 0.05mm; RoHS: TRUE; Temperature: -40°C to +125°C; Digikey Description: IC SMART DIODE CTLR 8VSSOP; Package: DGK0008A; Automotive: Yes; Device Class L3: unset; Manufacturer Part Number: LM74610QDGKTQ1; Category: IC; Device Class L1: Integrated Circuits (ICs); ComponentLink2URL: http://www.ti.com/lit/ds/symlink/lm74610-q1.pdf; ComponentLink2Description: Datasheet; Temperature Range Low: -40°C; Temperature Range High: +125°C; Device Class L2: Power Management ICs; Octopart: https://octopart.com/lm74610qdgktq1-texas+instruments-61765970; Ambient Temperature Range High: +125°C; Height: 1.1mm; Lead Free: Yes; Ambient Temperature Range Low: -40°C
U4 U5 = CMP-028-000000-2: Description; Manufacturer_Name: Diodes Inc; Design Item ID: SDT30B100D1-13; RefDes: RefDes; Manufacturer_Part_Number: SDT30B100D1-13; Source: SDT30B100D1-13.SchLib; Type: Type; Copyright: Copyright (C) 2025 Ultra Librarian. All rights reserved.
U6 = CMP-00001-1: IC REG LIN 3.3V 1A 8SON Linear Voltage Regulator IC Positive Fixed 1 Output 1A 8-SON (3x3); Manufacturer Lifecycle Status: ACTIVE; Dropout Voltage: 940mV; Number of Outputs: 1; Max Supply Voltage: 16V; Min Supply Voltage: 4.8V; Nominal Supply Current: 1.5mA; Accuracy: 0.5%; Max Junction Temperature (Tj): 150°C; Height: 1mm; Width: 3mm; Length: 3mm; Max Operating Temperature: 150°C; Thickness: 880µm; Output Voltage: 3.3V; Pins: 8; Lifecycle Status: Production; Output Current: 1A; Ambient Temperature Range High: 125°C; Min Operating Temperature: -40°C; RoHS: Compliant
U7 = CMP-0069-01741-3: Hysteretic PFET Buck Controller with Enable Pin, 8-pin MSOP, Pb-Free; Manufacturer: Texas Instruments; PackageTopMarking: ZXTT*STEB; CompType: Switcher; PowerWise: N; ComponentLink1URL: http://www.ti.com/general/docs/lit/getliterature.tsp?genericPartNumber=LM3489-Q1&fileType=pdf; PackageDescription: MINI SOIC, .118 x .118 x .034in, 8 Lead, .0256in Pitch; Code_JEDEC: MO-187-AA; ComponentLink1Description: Datasheet URL; PackageReference: DGK0008A; RoHS: Y; PinCount: 8
U8 = CMP-031-00006-4: 2.2MHz wide VIN low IQ synchronous boost controller 20-VQFN -40 to 150; Manufacturer_Name: Texas Instruments; Manufacturer_Part_Number: LM5123QRGRRQ1; Datasheet: https://www.ti.com/lit/gpn/lm5123-q1; TYPE: TYPE; RefDes: RefDes; Copyright: Copyright (C) 2025 Ultra Librarian. All rights reserved.; Design Item ID: LM5123QRGRRQ1; Source: LM5123QRGRRQ1.SchLib